# EAGLE schematic PCO_SMD_Feather_long (EAGLE 7.5.0)
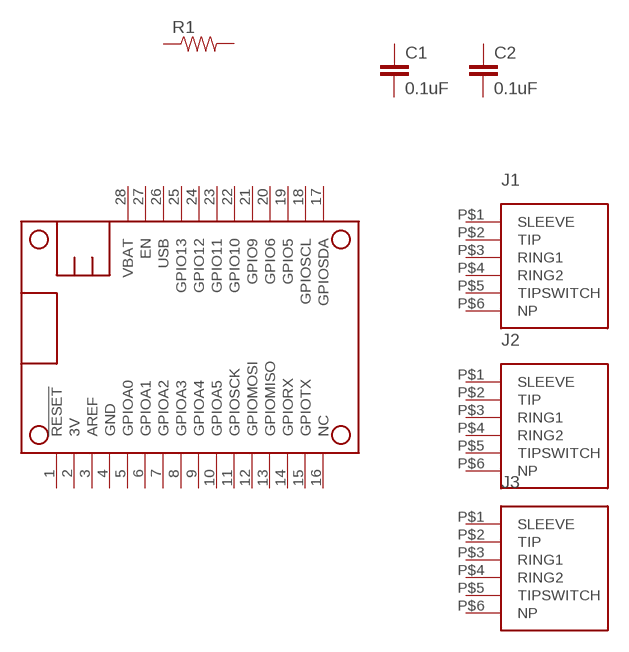
[diagram p0: schematic, sheet 1]

## Parts
C1  0.1uF  0.1UF-25V(+80/-20%)(0603)  [0603-CAP]
C2  0.1uF  0.1UF-25V(+80/-20%)(0603)  [0603-CAP]
J1  SJ-43515TS-SMT-TR  [SJ-43515TS-SMT-TR]
J2  SJ-43515TS-SMT-TR  [SJ-43515TS-SMT-TR]
J3  SJ-43515TS-SMT-TR  [SJ-43515TS-SMT-TR]
MS1  FEATHERWING_NODIM  [FEATHERWING_DIM]
R1  RESISTOR0603-RES  [0603-RES]
Unconnected: C1.1 C1.2 C2.1 C2.2 J1.P$1(SLEEVE) J1.P$2(TIP) J1.P$3(RING1) J1.P$4(RING2) J1.P$5(TIPSWITCH) J1.P$6(NP) J2.P$1(SLEEVE) J2.P$2(TIP) J2.P$3(RING1) J2.P$4(RING2) J2.P$5(TIPSWITCH) J2.P$6(NP) J3.P$1(SLEEVE) J3.P$2(TIP) J3.P$3(RING1) J3.P$4(RING2) J3.P$5(TIPSWITCH) J3.P$6(NP) MS1.1(!RESET) MS1.2(3V) MS1.3(AREF) MS1.5(GPIOA0) MS1.6(GPIOA1) MS1.7(GPIOA2) MS1.8(GPIOA3) MS1.9(GPIOA4) MS1.10(GPIOA5) MS1.11(GPIOSCK) MS1.12(GPIOMOSI) MS1.13(GPIOMISO) MS1.14(GPIORX) MS1.15(GPIOTX) MS1.16(NC) MS1.17(GPIOSDA) MS1.18(GPIOSCL) MS1.19(GPIO5) MS1.20(GPIO6) MS1.21(GPIO9) MS1.22(GPIO10) MS1.23(GPIO11) MS1.24(GPIO12) MS1.25(GPIO13) MS1.26(USB) MS1.27(EN) MS1.28(VBAT) R1.1 R1.2

## Power pins joined to a net without a drawn wire
GND: MS1.4(GND)

## Library data of the parts
C1 C2 = SparkFun-Capacitors:0.1UF-25V(+80/-20%)(0603): CAP-00810 Ceramic Standard decoupling cap; PROD_ID: CAP-00810
J1-J3 = transistor-pnp:SJ-43515TS-SMT-TR: SJ-43515TS-SMT-TR Mouser Part #: 490-SJ43515TS-SMT-TR Manufacturer Part #: SJ-43515TS-SMT-TR rated input voltage 12 Vdc rated input current 1 A Tip Switch
MS1 = adafruit:FEATHERWING
R1 = SparkFun-Passives:RESISTOR: Resistor Basic schematic elements and footprints for 0603, 1206, and PTH resistors.